# Altium schematic sheet aNoInv.SchDoc
size A4
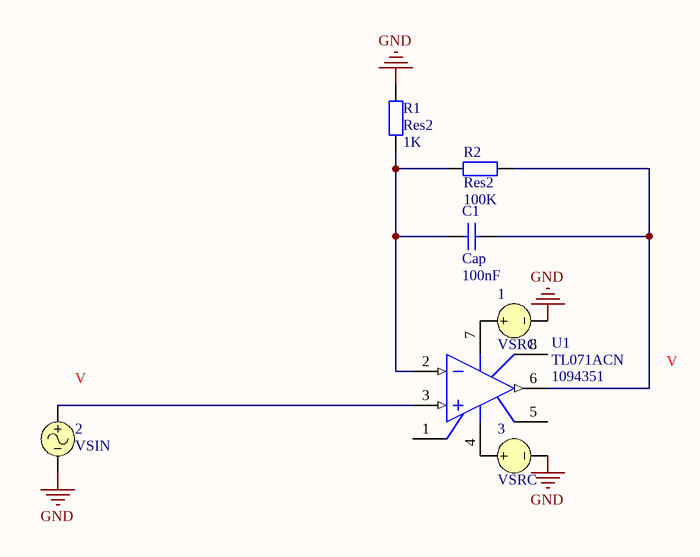
[diagram p0: aNoInv.SchDoc]

## Parts
1  VSRC
2  VSIN
3  VSRC
C1  Cap  value 100nF  [RAD-0.3]
R1  Res2  value 1K  [AXIAL-0.4]
R2  Res2  value 100K  [AXIAL-0.4]
U1  TL071ACN  Supplier Part Number 1: 1094351  [DIP8]

## Nets
GND: 1.2 2.2 3.2 R1.2
Net1_1: 1.1 U1.7(V+)
Net2_1: 2.1 U1.3(IN+)
Net3_1: 3.1 U1.4(V-)
NetC1_1: C1.1 R1.1 R2.1 U1.2(IN-)
NetC1_2: C1.2 R2.2 U1.6(OUT)

Not connected (* = marked no-connect by the designer): U1 1(OS_NULL) 5(OS_NULL) 8(NC)

## Library data of the parts
1 = VSRC: Voltage Source; Note: PCB Footprint - Not required; Value: +5; Published: 8-Jun-2000; LatestRevisionDate: 17-Jul-2002; LatestRevisionNote: Re-released for DXP Platform.; PackageReference: Not Applicable; Publisher: Altium Limited
2 = VSIN: Sinusoidal Voltage Source; Note: PCB Footprint - Not required; Published: 8-Jun-2000; LatestRevisionDate: 15-Nov-2004; LatestRevisionNote: Corrected Netlist.; PackageReference: Not Applicable; Publisher: Altium Limited
3 = VSRC: Voltage Source; Note: PCB Footprint - Not required; Value: -5; Published: 8-Jun-2000; LatestRevisionDate: 17-Jul-2002; LatestRevisionNote: Re-released for DXP Platform.; PackageReference: Not Applicable; Publisher: Altium Limited
C1 = Cap: Capacitor; Published: 8-Jun-2000; LatestRevisionDate: 17-Jul-2002; LatestRevisionNote: Re-released for DXP Platform.; PackageReference: RAD-0.3; Publisher: Altium Limited; PackageDescription: Radial Cap, Thru-Hole; 2 Leads; 0.3 in Pin Spacing
R1 R2 = Res2: Resistor; Published: 8-Jun-2000; LatestRevisionDate: 17-Jul-2002; LatestRevisionNote: Re-released for DXP Platform.; PackageReference: AXIAL-0.4; Publisher: Altium Limited; PackageDescription: Axial Device, Thru-Hole; 2 Leads; 0.4 in Pin Spacing
U1 = TL071ACN: Low-Noise J-FET Single Operational Amplifier; Manufacturer: STMicroelectronics; Manufacturer Part Number: TL071CN; Op Amp Type: Low Noise; No. of Amplifiers: 1; Amplifier Case Style: DIP; Bandwidth: 4MHz; Supply Voltage Range: 6V to 36V; No. of Pins: 8; Slew Rate: 16V/µs; SVHC: No SVHC (16-Jun-2014); Published: 24-Aug-2001; LatestRevisionDate: 06-Jun-2005; LatestRevisionNote: Stylized 3D Model Added.; DatasheetVersion: Dec-1998; PackageReference: DIP8; Publisher: Altium Limited; PackageDescription: DIP; 8 Leads; Row Spacing 7.62 mm; Pitch 2.54 mm; Code_JEDEC: MO-001-AN; ComponentLink1Description: Manufacturer Link; ComponentLink1URL: http://www.st.com/; ComponentLink2Description: Datasheet; ComponentLink2URL: http://www.st.com/stonline/products/literature/ds/2296/tl071.pdf; Supplier 1: Farnell; Stock 1: 0; Pricing 1: 1=0.443, 10=0.301, 100=0.24, 250=0.216, 500=0.206, 800=0.185, 3000=0.167, 8000=0.15 (EUR); Operating Temperature Min: 0°C; Operating Temperature Max: 70°C; Packaging: Each; ComponentLink3URL: https://datasheet.ciiva.com/15129/getdatasheetpartid-40922-15129707.pdf; ComponentLink3Description: https://datasheet.ciiva.com/15129/getdatasheetpartid-40922-15129707.pdf; ComponentLink4URL: https://datasheet.ciiva.com/17093/tl071cn-17093041.pdf; ComponentLink4Description: https://datasheet.ciiva.com/17093/tl071cn-17093041.pdf; ComponentLink5URL: https://datasheet.ciiva.com/4757/cd00000488-106056-4757056.pdf; ComponentLink5Description: https://datasheet.ciiva.com/4757/cd00000488-106056-4757056.pdf; ComponentLink6URL: https://datasheet.ciiva.com/29306/155614-da-01-en-op-verst-tl071cn-stm-29306836.pdf; ComponentLink6Description: https://datasheet.ciiva.com/29306/155614-da-01-en-op-verst-tl071cn-stm-29306836.pdf; ComponentLink7URL: https://datasheet.ciiva.com/26848/tl071cn-26848115.pdf; ComponentLink7Description: https://datasheet.ciiva.com/26848/tl071cn-26848115.pdf; ComponentLink8URL: https://datasheet.ciiva.com/16206/cd00000488-16206949.pdf; ComponentLink8Description: https://datasheet.ciiva.com/16206/cd00000488-16206949.pdf; ComponentLink9URL: https://datasheet.ciiva.com/8008/1690308-8008554.pdf; ComponentLink9Description: https://datasheet.ciiva.com/8008/1690308-8008554.pdf; ComponentLink10URL: https://datasheet.ciiva.com/1796/cd00000488-1796697.pdf; ComponentLink10Description: https://datasheet.ciiva.com/1796/cd00000488-1796697.pdf